# Altium schematic sheet LM74610QDGKRQ1_PPCONTR.SchDoc
size A3; SheetNumber: 3; SheetTotal: 3
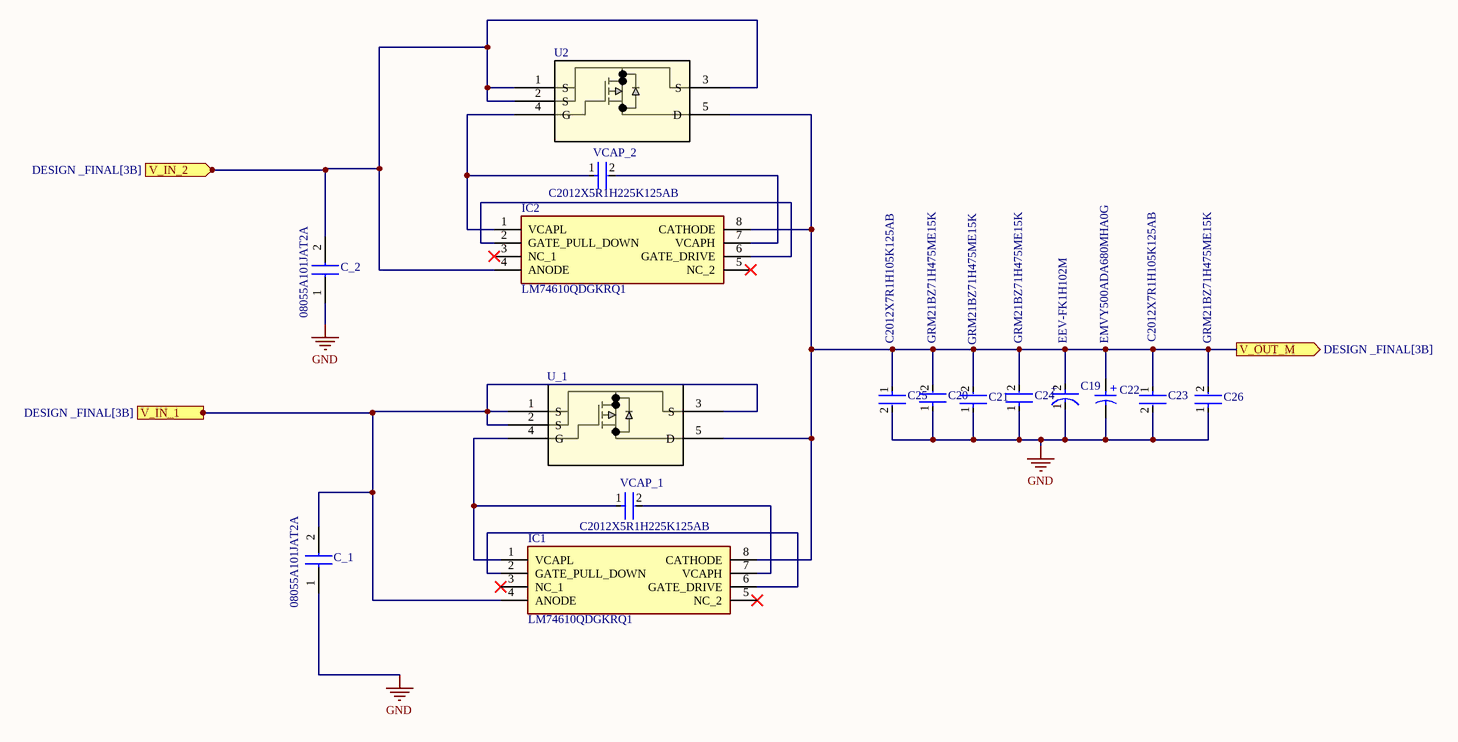
[diagram p0: LM74610QDGKRQ1_PPCONTR.SchDoc]

## Parts
C19  EEV-FK1H102M  [FP-FK-J16-MFG]
C20  GRM21BZ71H475ME15K  [FP-GRM21B-0_2-e0_2_0_7-MFG]
C21  GRM21BZ71H475ME15K  [FP-GRM21B-0_2-e0_2_0_7-MFG]
C22  EMVY500ADA680MHA0G  [WCAP-ASLI_D8H10.5]
C23  C2012X7R1H105K125AB  [FP-C2012-125-0_2-MFG]
C24  GRM21BZ71H475ME15K  [FP-GRM21B-0_2-e0_2_0_7-MFG]
C25  C2012X7R1H105K125AB  [FP-C2012-125-0_2-MFG]
C26  GRM21BZ71H475ME15K  [FP-GRM21B-0_2-e0_2_0_7-MFG]
C_1  08055A101JAT2A  [GRM21BR60J226ME39L]
C_2  08055A101JAT2A  [GRM21BR60J226ME39L]
IC1  LM74610QDGKRQ1  [SOP65P490X110-8N]
IC2  LM74610QDGKRQ1  [SOP65P490X110-8N]
U2  SQJ422EP-T1_GE3  [SO-8L_VIS]  (value not drawn)
U_1  SQJ422EP-T1_GE3  [SO-8L_VIS]  (value not drawn)
VCAP_1  C2012X5R1H225K125AB  [FP-C2012-125-0_2-IPC_C]
VCAP_2  C2012X5R1H225K125AB  [FP-C2012-125-0_2-IPC_C]

## Ports
V_IN_1 (in, see DESIGN _FINAL[3B]), V_IN_2 (in, see DESIGN _FINAL[3B]), V_OUT_M (out, see DESIGN _FINAL[3B])

## Nets
GND: C19.1(C) C20.1 C21.1 C22.2(N) C23.2 C24.1 C25.2 C26.1 C_1.1 C_2.1
V_IN_1: C_1.2 IC1.4(ANODE) U_1.1(S) U_1.2(S) U_1.3(S) ; port V_IN_1
V_IN_2: C_2.2 IC2.4(ANODE) U2.1(S) U2.2(S) U2.3(S) ; port V_IN_2
V_OUT_M: C19.2(A) C20.2 C21.2 C22.1(P) C23.1 C24.2 C25.1 C26.2 IC1.8(CATHODE) IC2.8(CATHODE) U2.5(D) U_1.5(D) ; port V_OUT_M
NetIC1_1: IC1.1(VCAPL) U_1.4(G) VCAP_1.1
NetIC1_2: IC1.2(GATE_PULL_DOWN) IC1.6(GATE_DRIVE)
NetIC1_7: IC1.7(VCAPH) VCAP_1.2
NetIC2_1: IC2.1(VCAPL) U2.4(G) VCAP_2.1
NetIC2_2: IC2.2(GATE_PULL_DOWN) IC2.6(GATE_DRIVE)
NetIC2_7: IC2.7(VCAPH) VCAP_2.2

Not connected (* = marked no-connect by the designer): IC1 3(NC_1)* 5(NC_2)*; IC2 3(NC_1)* 5(NC_2)*

## Notes on the sheet
- (in symbol CMP-03913-53914624-1) +
- (in symbol CMP-05427-000011-1) +

## Library data of the parts
C19 = CMP-05427-000011-1: CAP ALUM 1000UF 20% 50V SMD; Manufacturer: Panasonic Electronic Components; Esr: 0.073Ω; Life: 2000Hours; Leakage Current: 500uA; Ripple Current: 1610mA; Dissipation Factor: 10%; Automotive Grade: Grade 2; Material: Aluminum; Capacitance: 1000uF; Tolerance: 20%; Device Class L1: Passive Components; Temperature: -55°C to +105°C; Device Class L2: Capacitors; Mouser Description: Cap Aluminum Lytic 1000uF 50V 20% (16 X 16.5mm) SMD 0.073 Ohm 1610mA 2000h 105C Automotive T/R; Category: Cap; Digikey Description: CAP ALUM 1000UF 20% 50V SMD; Value: 1000uF; Manufacturer Part Number: EEV-FK1H102M; Lead Free: Yes; Octopart: https://octopart.com/eev-fk1h102m-panasonic-39480688; Temperature Range High: +105°C; Package: FK-J16; Device Class L3: Aluminum Electrolytic Capacitors; ComponentLink2Description: Datasheet; RoHS: TRUE; Height: 17mm; ComponentLink2URL: https://b2b-api.panasonic.eu/file_stream/pids/fileversion/3127; Voltage Rating: 50V; Temperature Range Low: -55°C; Automotive: Yes
C20 C21 C24 C26 = CMP-06035-012295-1: Chip Multilayer Ceramic Capacitors for General Purpose, 0805, 4.7uF, X7R, 15%, 20%, 50V
C22 = CMP-03913-53914624-1: 865080653015 WCAP-ASLI Aluminum Electrolytic Capacitors; ESR (Equivalent Series Resistance): 276.092mΩ; Voltage Rating: 50V; Tolerance: 20%; Leakage Current: 34µA; Polarity: Polar; Life (Hours): 2000hours; Ripple Current: 320mA; Capacitance: 68µF; Insulation Resistance: 1.47059MΩ; Impedance: 500mΩ; Value: 68µF; Packaging: Tape & Reel (TR); Min Operating Temperature: -55°C; Max Operating Temperature: 105°C; Height - Seated (Max): 10.4902mm; Mount: Surface Mount; Width: 8.3mm; Height: 10.5mm; Diameter: 8mm; Ripple Current (AC): 320mA; RoHS: Compliant; Case/Package: Radial; REACH SVHC: Unknown; NexarPartId: 53914624; Voltage Rating (DC): 50V; Length: 10.5mm
C23 C25 = CMP-08246-006515-1: Multilayer Ceramic Capacitors 1μF ±10% 50V X7R SMD 0805; Capacitance: 1uF; Value: 1uF; Thickness: 0.057inch; REACH SVHC: No SVHC; Dielectric: X7R; Termination: SMD/SMT; Length: 2mm; Package Quantity: 1; Min Operating Temperature: -55°C; Number of Pins: 2; Series: C; Lead Free: Lead Free; Case/Package: 0805; Packaging: Tape and Reel; Voltage Rating (DC): 50V; Voltage Rating: 50V; Case Code (Imperial): 0805; Case Code (Metric): 2012; RoHS Compliant: Yes; Construction: Flat; Radiation Hardening: No; Weight: 0.000194oz; Resistor Type: Ceramic; Width: 0.049inch; Mount: Surface Mount; Max Operating Temperature: 125°C; Dielectric Material: Ceramic; Height: 1.25mm; Depth: 1.25mm; Tolerance: 10%
C_1 C_2 = GRM21BR61H106KE43L: Capacitor; Manufacturer_Name: Murata Electronics; Datasheet Link: https://search.murata.co.jp/Ceramy/image/img/A01X/G101/ENG/GRM21BR61H106KE43-01A.pdf; Height: 1.45mm; Manufacturer_Part_Number: GRM21BR61H106KE43L; Mouser Part Number: 81-GRM21BR61H106KE3L; Mouser Price/Stock: https://www.mouser.co.uk/ProductDetail/Murata-Electronics/GRM21BR61H106KE43L?qs=lYGu3FyN48cBZlIduWKclg%3D%3D; Arrow Part Number: GRM21BR61H106KE43L; Arrow Price/Stock: https://www.arrow.com/en/products/grm21br61h106ke43l/murata-manufacturing?utm_currency=USD&region=europe
IC1 IC2 = LM74610QDGKRQ1: Integrated Circuit; Manufacturer_Name: Texas Instruments; Datasheet Link: http://www.ti.com/lit/gpn/lm74610-q1; Height: 1.1mm; Manufacturer_Part_Number: LM74610QDGKRQ1; Mouser Part Number: 595-LM74610QDGKRQ1; Mouser Price/Stock: https://www.mouser.co.uk/ProductDetail/Texas-Instruments/LM74610QDGKRQ1?qs=3jdCaFhktOQTVpuuubgDqg%3D%3D; Arrow Part Number: LM74610QDGKRQ1; Arrow Price/Stock: https://www.arrow.com/en/products/lm74610qdgkrq1/texas-instruments?region=nac
U2 U_1 = SQJ422EP-T1_GE3: N-CHANNEL 40-V (D-S) 175C MOSFET; Manufacturer_Name: Vishay; Copyright: Copyright (C) 2025 Ultra Librarian. All rights reserved.; Manufacturer_Part_Number: SQJ422EP-T1_GE3; Datasheet: https://www.vishay.com/doc?63989; RefDes: RefDes; Type: Type
VCAP_1 VCAP_2 = CMP-08246-005698-1: Multilayer Ceramic Capacitors 2.2μF ±10% 50V X5R SMD 0805; Insulation Resistance: 10GR; Dissipation Factor: 5%; Capacitance: 2.2uF; Width: 1.2mm; Packaging: Tape and Reel; REACH SVHC: No SVHC; Dielectric: X5R; Dielectric Material: Ceramic; Voltage Rating: 50V; Radiation Hardening: No; Height: 1.25mm; Termination: SMD/SMT; Max Operating Temperature: 85°C; Resistor Type: Ceramic; Package Quantity: 1; Min Operating Temperature: -55°C; Weight: 0.000194oz; Thickness: 0.057inch; Lead Free: Lead Free; Tolerance: 10%; Voltage Rating (DC): 50V; RoHS Compliant: Yes; Construction: Flat; Mount: Surface Mount; Depth: 1.25mm; Length: 2mm; Case Code (Imperial): 0805; Case/Package: 0805; Series: C; Case Code (Metric): 2012